# EAGLE design Termocupla (EAGLE 5.08)
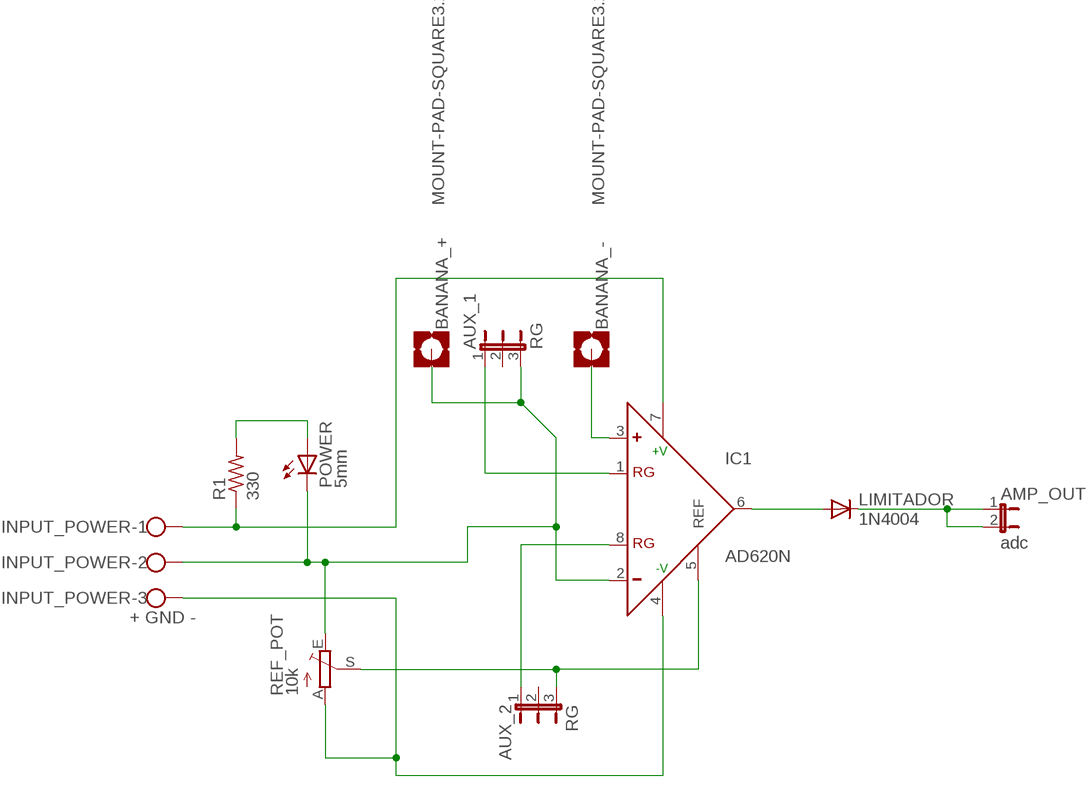
[diagram p0: schematic, sheet 1]

## Parts
AMP_OUT  adc  JP1E  [JP1]
AUX_1  RG  JP2E  [JP2]
AUX_2  RG  JP2E  [JP2]
BANANA_+  MOUNT-PAD-SQUARE3.2  [3,2-PAD-SQUARE]
BANANA_-  MOUNT-PAD-SQUARE3.2  [3,2-PAD-SQUARE]
IC1  AD620N  [DIL08]
INPUT_POWER  + GND -  W237-103  [W237-103]
LIMITADOR  1N4004  [DO41-10]
POWER  5mm  LED5MM  [LED5MM]
R1  330  R-US_0207/12  [0207/12]
REF_POT  10k  TRIM_EU-B25X  [B25X]

## Nets
GND: AUX_1.3 BANANA_+.B3,2(MOUNT) IC1.2(-) INPUT_POWER.2 POWER.K(C) REF_POT.E
N$1: IC1.7(+V) INPUT_POWER.1 R1.1
N$2: POWER.A R1.2
N$3: AMP_OUT.1 AMP_OUT.2 LIMITADOR.C
N$4: IC1.4(-V) INPUT_POWER.3 REF_POT.A
N$5: AUX_1.1 IC1.1(RG)
N$6: AUX_2.1 IC1.8(RG)
N$7: IC1.6(OUT) LIMITADOR.A
N$9: BANANA_-.B3,2(MOUNT) IC1.3(+)
N$10: AUX_2.3 IC1.5(REF) REF_POT.S
Unconnected: AUX_1.2 AUX_2.2

## Library data of the parts
AMP_OUT = jumper:JP1E: JUMPER
AUX_1 AUX_2 = jumper:JP2E: JUMPER
BANANA_+ BANANA_- = holes:MOUNT-PAD-SQUARE: MOUNTING PAD, square
IC1 = analog-devices:AD620: Low Cost, Low Power, Instrumentation Amplifier Source: http://www.analog.com/UploadedFiles/Data_Sheets/37793330023930AD620_e.pdf
INPUT_POWER = con-wago-500:W237-103: WAGO SCREW CLAMP
LIMITADOR = diode:1N4004: DIODE general purpose rectifier, 1 A
POWER = led:LED: LED OSRAM: - CHIPLED LG R971, LG N971, LY N971, LG Q971, LY Q971, LO R971, LY R971 LH N974, LH R974 LS Q976, LO Q976, LY Q976 LO Q996 - Hyper CHIPLED LW Q18S LB Q993, LB Q99A, LB R99A - SideLED LS A670, LO A670, LY A670, LG A670, LP A670 LB A673, LV A673, LT A673, LW A673 LH A674 LY A675 LS A676, LA A676, LO A676, LY A676, LW A676 LS A679, LY A679, LG A679 - Hyper Micro SIDELED® LS Y876, LA Y876, LO Y876, LY Y876 LT Y87S - SmartLED LW L88C, LW L88S LB L89C, LB L89S, LG L890 LS L89K, LO L89K, LY L89K LS L896, LA L896, LO L896, LY L896 - TOPLED LS T670, LO T670, LY T670, LG T670, LP T670 LSG T670, LSP T670, LSY T670, LOP T670, LYG T670 LG T671, LOG T671, LSG T671 LB T673, LV T673, LT T673, LW T673 LH T674 LS T676, LA T676, LO T676, LY T676, LB T676, LH T676, LSB T676, LW T676 LB T67C, LV T67C, LT T67C, LS T67K, LO T67K, LY T67K, LW E67C LS E67B, LA E67B, LO E67B, LY E67B, LB E67C, LV E67C, LT E67C LW T67C LS T679, LY T679, LG T679 LS T770, LO T770, LY T770, LG T770, LP T770 LB T773, LV T773, LT T773, LW T773 LH T774 LS E675, LA E675, LY E675, LS T675 LS T776, LA T776, LO T776, LY T776, LB T776 LHGB T686 LT T68C, LB T68C - Hyper Mini TOPLED® LB M676 - Mini TOPLED Santana® LG M470 LS M47K, LO M47K, LY M47K Source: http://www.osram.convergy.de LUXEON: - LUMILED® LXK2-PW12-R00, LXK2-PW12-S00, LXK2-PW14-U00, LXK2-PW14-V00 LXK2-PM12-R00, LXK2-PM12-S00, LXK2-PM14-U00 LXK2-PE12-Q00, LXK2-PE12-R00, LXK2-PE12-S00, LXK2-PE14-T00, LXK2-PE14-U00 LXK2-PB12-K00, LXK2-PB12-L00, LXK2-PB12-M00, LXK2-PB14-N00, LXK2-PB14-P00, LXK2-PB14-Q00 LXK2-PR12-L00, LXK2-PR12-M00, LXK2-PR14-Q00, LXK2-PR14-R00 LXK2-PD12-Q00, LXK2-PD12-R00, LXK2-PD12-S00 LXK2-PH12-R00, LXK2-PH12-S00 LXK2-PL12-P00, LXK2-PL12-Q00, LXK2-PL12-R00 Source: www.luxeon.com KINGBRIGHT: KA-3528ASYC Source: www.kingbright.com
R1 = rcl:R-US_: RESISTOR, American symbol
REF_POT = pot:TRIM_EU-: POTENTIOMETER

## Board
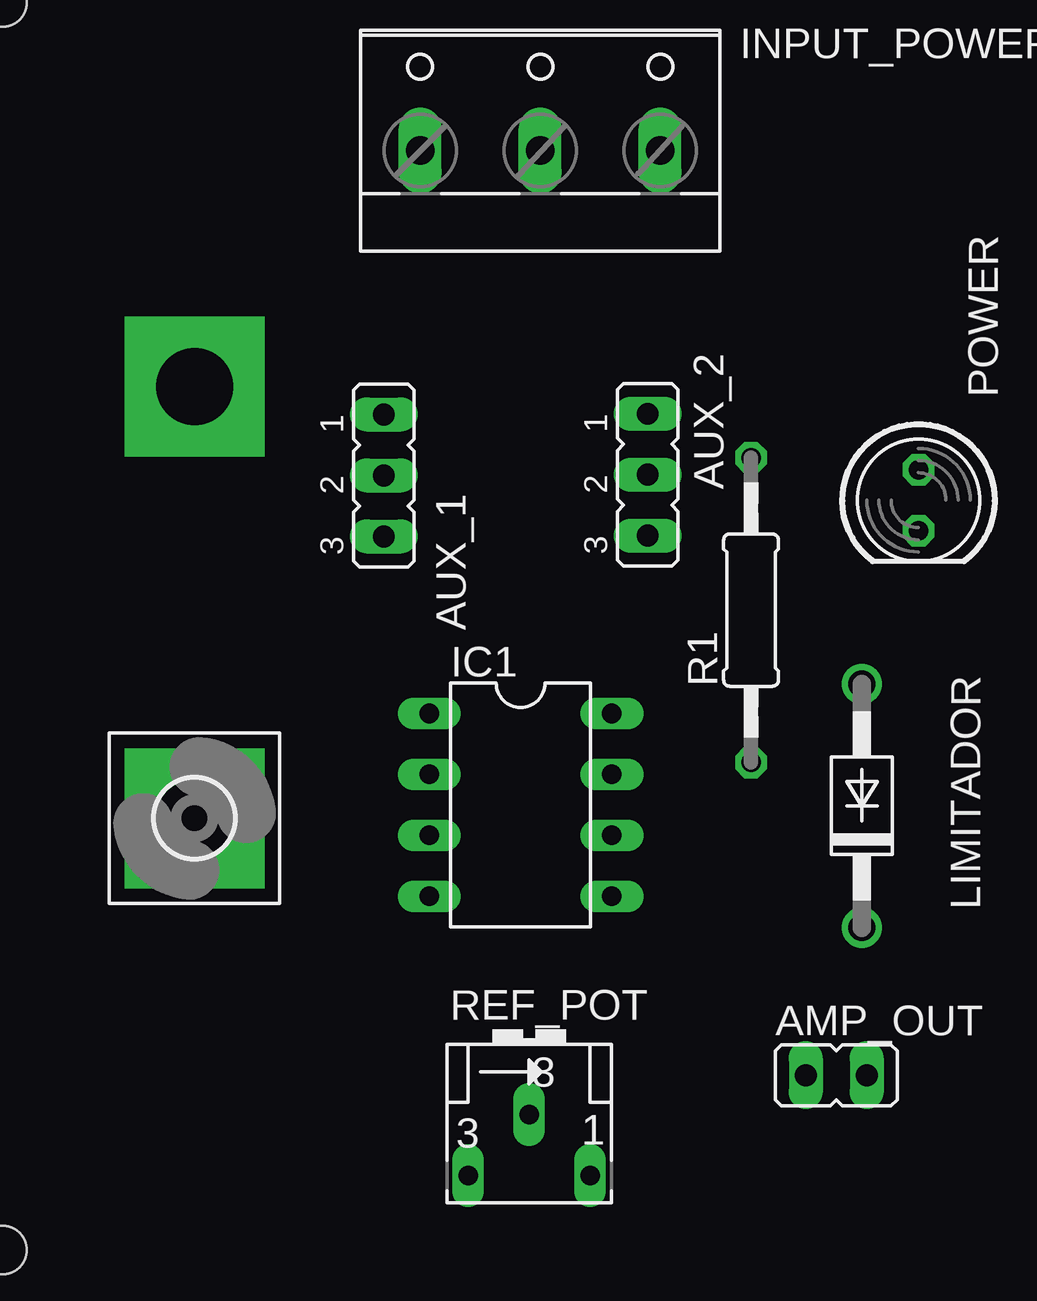
[diagram p1: board, top side]
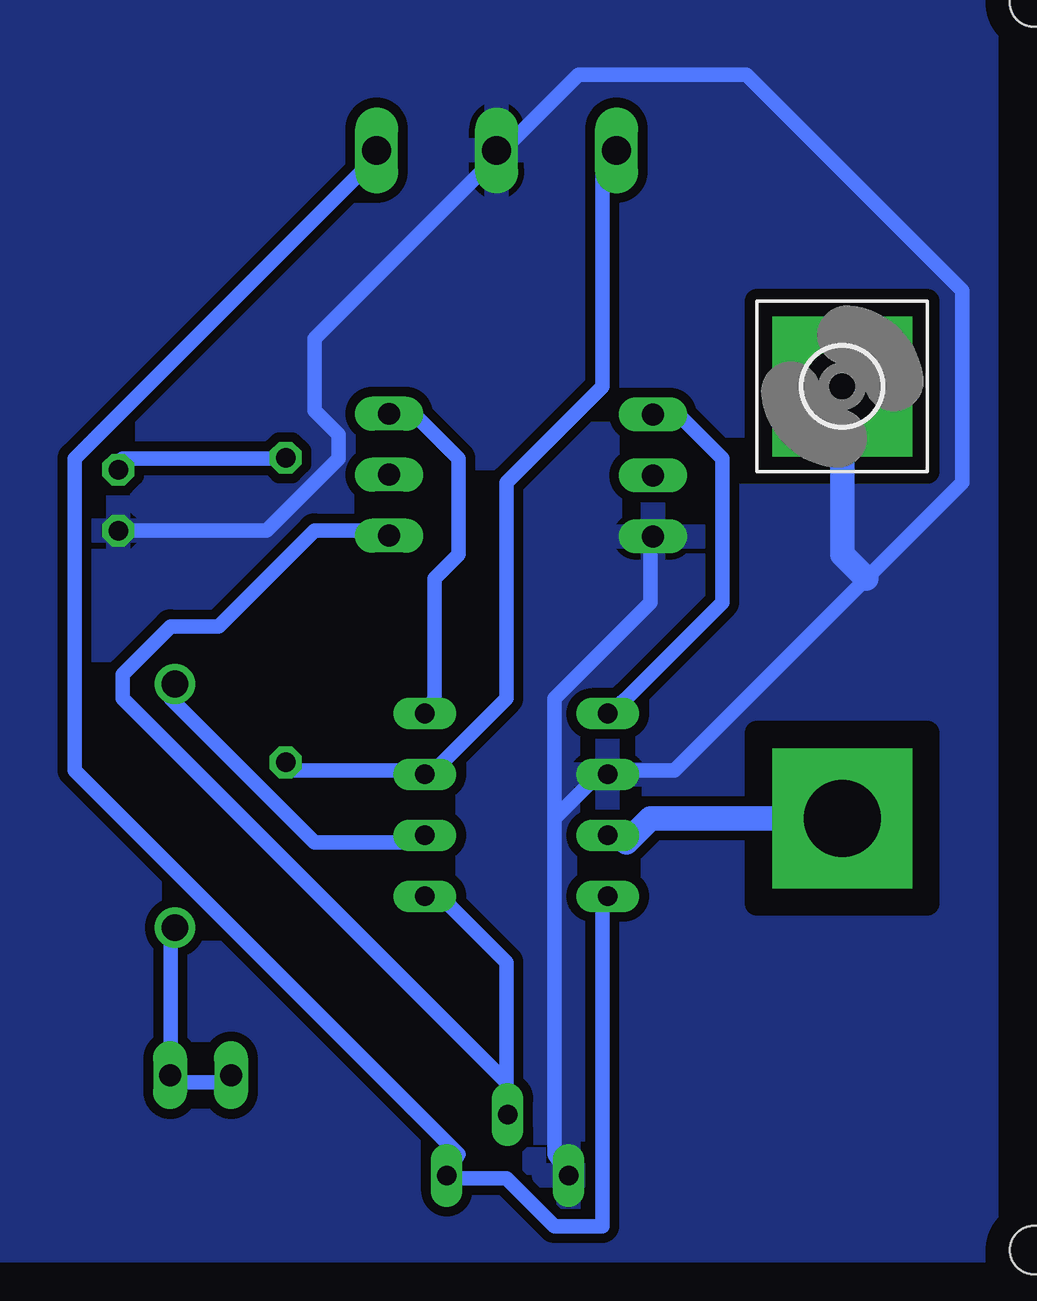
[diagram p2: board, bottom side, seen from below]

No outline drawn. Coordinates in mm, seen from the top.
Copper layers (1*16): Top 0.035mm / dielectric 1.5mm / Bottom 0.035mm
Design rules "default *": minimum track width 24mil, minimum drill 24mil, track to track 16mil, track to pad 16mil, pad to pad 16mil, via to via 16mil, smd to smd 8mil, copper to edge 40mil, drill to drill 8mil, minimum pad ring 10mil, minimum via ring 8mil, stop-mask expansion 4mil, vias tented up to drill 0mil, thermal gap 10mil
Holes 2 mm at 5,8 53,8 53,60 5,60

### Footprints (pad centres in the part's own frame; a part is rotated, then mirrored left to right if it is on the bottom)
JP1 = drill 0.914 long: 1 0,-1.27; 2 0,1.27
JP2 = drill 0.914 long: 1 -2.54,0; 2 0,0; 3 2.54,0
3,2-PAD-SQUARE = drill 3.2 pad 5.842 square: B3,2 0,0
DIL08 = drill 0.813 long: 1 -3.81,-3.81; 2 -1.27,-3.81; 3 1.27,-3.81; 4 3.81,-3.81; 5 3.81,3.81; 6 1.27,3.81; 7 -1.27,3.81; 8 -3.81,3.81
W237-103 = drill 1.194 long: 1 -5,-1.29; 2 0,-1.29; 3 5,-1.29
DO41-10 = drill 1.118 round: A 5.08,0; C -5.08,0
LED5MM = drill 0.813 octagon: A -1.27,0; K 1.27,0
0207/12 = drill 0.813 octagon: 1 -6.35,0; 2 6.35,0
B25X = drill 0.813 long: A 2.54,-1.905; E -2.54,-1.905; S 0,0.635

### Placement (x,y rotation side)
AMP_OUT  39.75,15.29 270 top
AUX_1  20.89,40.29 270 top
AUX_2  31.89,40.32 270 top
BANANA_+  13,44 0 bottom
BANANA_-  13,26 0 top
IC1  26.59,26.56 270 top
INPUT_POWER  27.41,55.13 0 top
LIMITADOR  40.82,26.52 90 top
POWER  43.18,39.26 270 top
R1  36.2,34.68 90 top
REF_POT  26.95,13.02 0 top

### Tracks (layer width: path | path; a pad name or v marks a point on that pad's centre or on a via)
GND
  Bottom 0.61: 25,26 23,28 IC1.2 22,28 20,28 12,36 8,40 8,48 17,57 24,57 27,54 INPUT_POWER.2 28,53 35,46 35,43 34,42 34,41 37,38 43,38 POWER.K | 25,26 25,12 REF_POT.E | 25,26 25,31 21,35 21,38 AUX_1.3
  Bottom 1.016: BANANA_+.B3,2 13,37 12,36
  pour Bottom: 7,9 7,60 50,60 50,8 7,8
N$1
  Bottom 0.61: R1.1 36,28 31,28 IC1.7 30,28 27,31 27,40 23,44 23,53 INPUT_POWER.1
N$2
  Bottom 0.61: POWER.A 43,41 36,41 R1.2
N$3
  Bottom 0.61: AMP_OUT.1 39,15 41,15 AMP_OUT.2 41,16 41,21 LIMITADOR.C
N$4
  Bottom 0.61: IC1.4 23,23 23,9 25,9 27,11 29,11 REF_POT.A 29,12 45,28 45,41 33,53 INPUT_POWER.3
N$5
  Bottom 0.61: IC1.1 22,31 18,35 18,41 20,43 AUX_1.1
N$6
  Bottom 0.61: IC1.8 30,31 30,36 29,37 29,41 31,43 AUX_2.1
N$7
  Bottom 0.61: IC1.6 31,25 35,25 41,31 LIMITADOR.A
N$9
  Bottom 1.016: BANANA_-.B3,2 21,26 22,25 22.29,25.29 IC1.3
N$10
  Bottom 0.61: 27,15 27,20 30,23 IC1.5 | 27,15 27,14 REF_POT.S | 27,15 43,31 43,32 41,34 39,34 35,38 32,38 AUX_2.3